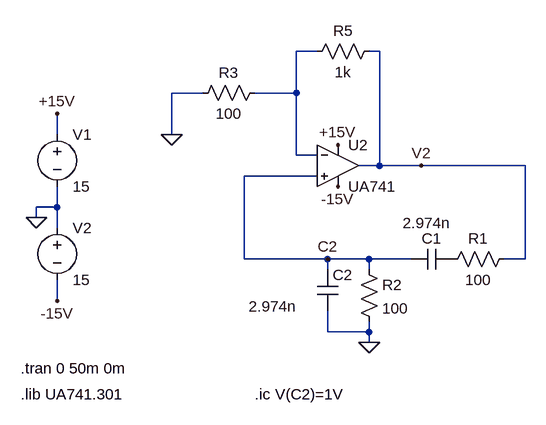
[diagram p0: schematic sim_part2_RC_ex1.asc]
sim_part2_RC_ex1.asc, the LTspice schematic file:
Version 4
SHEET 1 880 680
WIRE 144 -144 112 -144
WIRE 240 -144 224 -144
WIRE -32 -80 -80 -80
WIRE 112 -80 112 -144
WIRE 112 -80 48 -80
WIRE -256 -16 -256 -48
WIRE -80 -16 -80 -80
WIRE 112 16 112 -80
WIRE 144 16 112 16
WIRE 240 32 240 -144
WIRE 240 32 208 32
WIRE 304 32 240 32
WIRE 464 32 304 32
WIRE 144 48 32 48
WIRE -256 96 -256 64
WIRE -256 96 -288 96
WIRE -288 112 -288 96
WIRE -256 128 -256 96
WIRE 32 176 32 48
WIRE 160 176 32 176
WIRE 224 176 160 176
WIRE 288 176 224 176
WIRE 464 176 464 32
WIRE 464 176 432 176
WIRE 160 192 160 176
WIRE 224 192 224 176
WIRE -256 240 -256 208
WIRE 160 288 160 256
WIRE 224 288 224 272
WIRE 224 288 160 288
WIRE 224 304 224 288
FLAG -288 112 0
FLAG -256 -48 +15V
FLAG -256 240 -15V
FLAG 176 0 +15V
FLAG 176 64 -15V
FLAG 304 32 V2
FLAG 224 304 0
FLAG -80 -16 0
FLAG 160 176 C2
SYMBOL voltage -256 -32 R0
WINDOW 123 0 0 Left 0
WINDOW 39 0 0 Left 0
SYMATTR InstName V1
SYMATTR Value 15
SYMBOL voltage -256 112 R0
WINDOW 123 0 0 Left 0
WINDOW 39 0 0 Left 0
SYMATTR InstName V2
SYMATTR Value 15
SYMBOL res 240 -160 R90
WINDOW 0 0 56 VBottom 2
WINDOW 3 32 56 VTop 2
SYMATTR InstName R5
SYMATTR Value 1k
SYMBOL OpAmps\\opamp2 176 -32 R0
SYMATTR InstName U2
SYMATTR Value UA741
SYMBOL res 448 160 R90
WINDOW 0 0 56 VBottom 2
WINDOW 3 32 56 VTop 2
SYMATTR InstName R1
SYMATTR Value 100
SYMBOL cap 352 160 R90
WINDOW 0 0 32 VBottom 2
WINDOW 3 -55 39 VTop 2
SYMATTR InstName C1
SYMATTR Value 2.974n
SYMBOL res 208 176 R0
SYMATTR InstName R2
SYMATTR Value 100
SYMBOL cap 144 192 R0
WINDOW 3 -105 57 Left 2
SYMATTR Value 2.974n
SYMATTR InstName C2
SYMBOL res 64 -96 R90
WINDOW 0 0 56 VBottom 2
WINDOW 3 32 56 VTop 2
SYMATTR InstName R3
SYMATTR Value 100
TEXT -312 344 Left 2 !.tran 0 50m 0m
TEXT -312 384 Left 2 !.lib UA741.301
TEXT 48 384 Left 2 !.ic V(C2)=1V

The netlist it stands for:
* sim_part2_RC_ex1.asc
V1 +15V 0 15
V2 0 -15V 15
R5 V2 N001 1k
XU2 C2 N001 +15V -15V V2 UA741  ; pins In+ In- V+ V- OUT
R1 V2 P001 100
C1 P001 C2 2.974n
R2 C2 0 100
C2 C2 0 2.974n
R3 N001 0 100
.tran 0 50m 0m
.lib UA741.301
.ic V(C2)=1V
.backanno
.end